# EasyEDA Pro project uven2-mk3-main-board.eprj

# Schematic Schematic1
Board Name: Board1; Create Date: 2025-07-13; Page Name: P1; Project Name: uven2-mk3-main-board; Schematic Name: Schematic1; Update Date: 2025-12-18; Company: EasyEDA.com; Page Size: A4; Version: V1.3
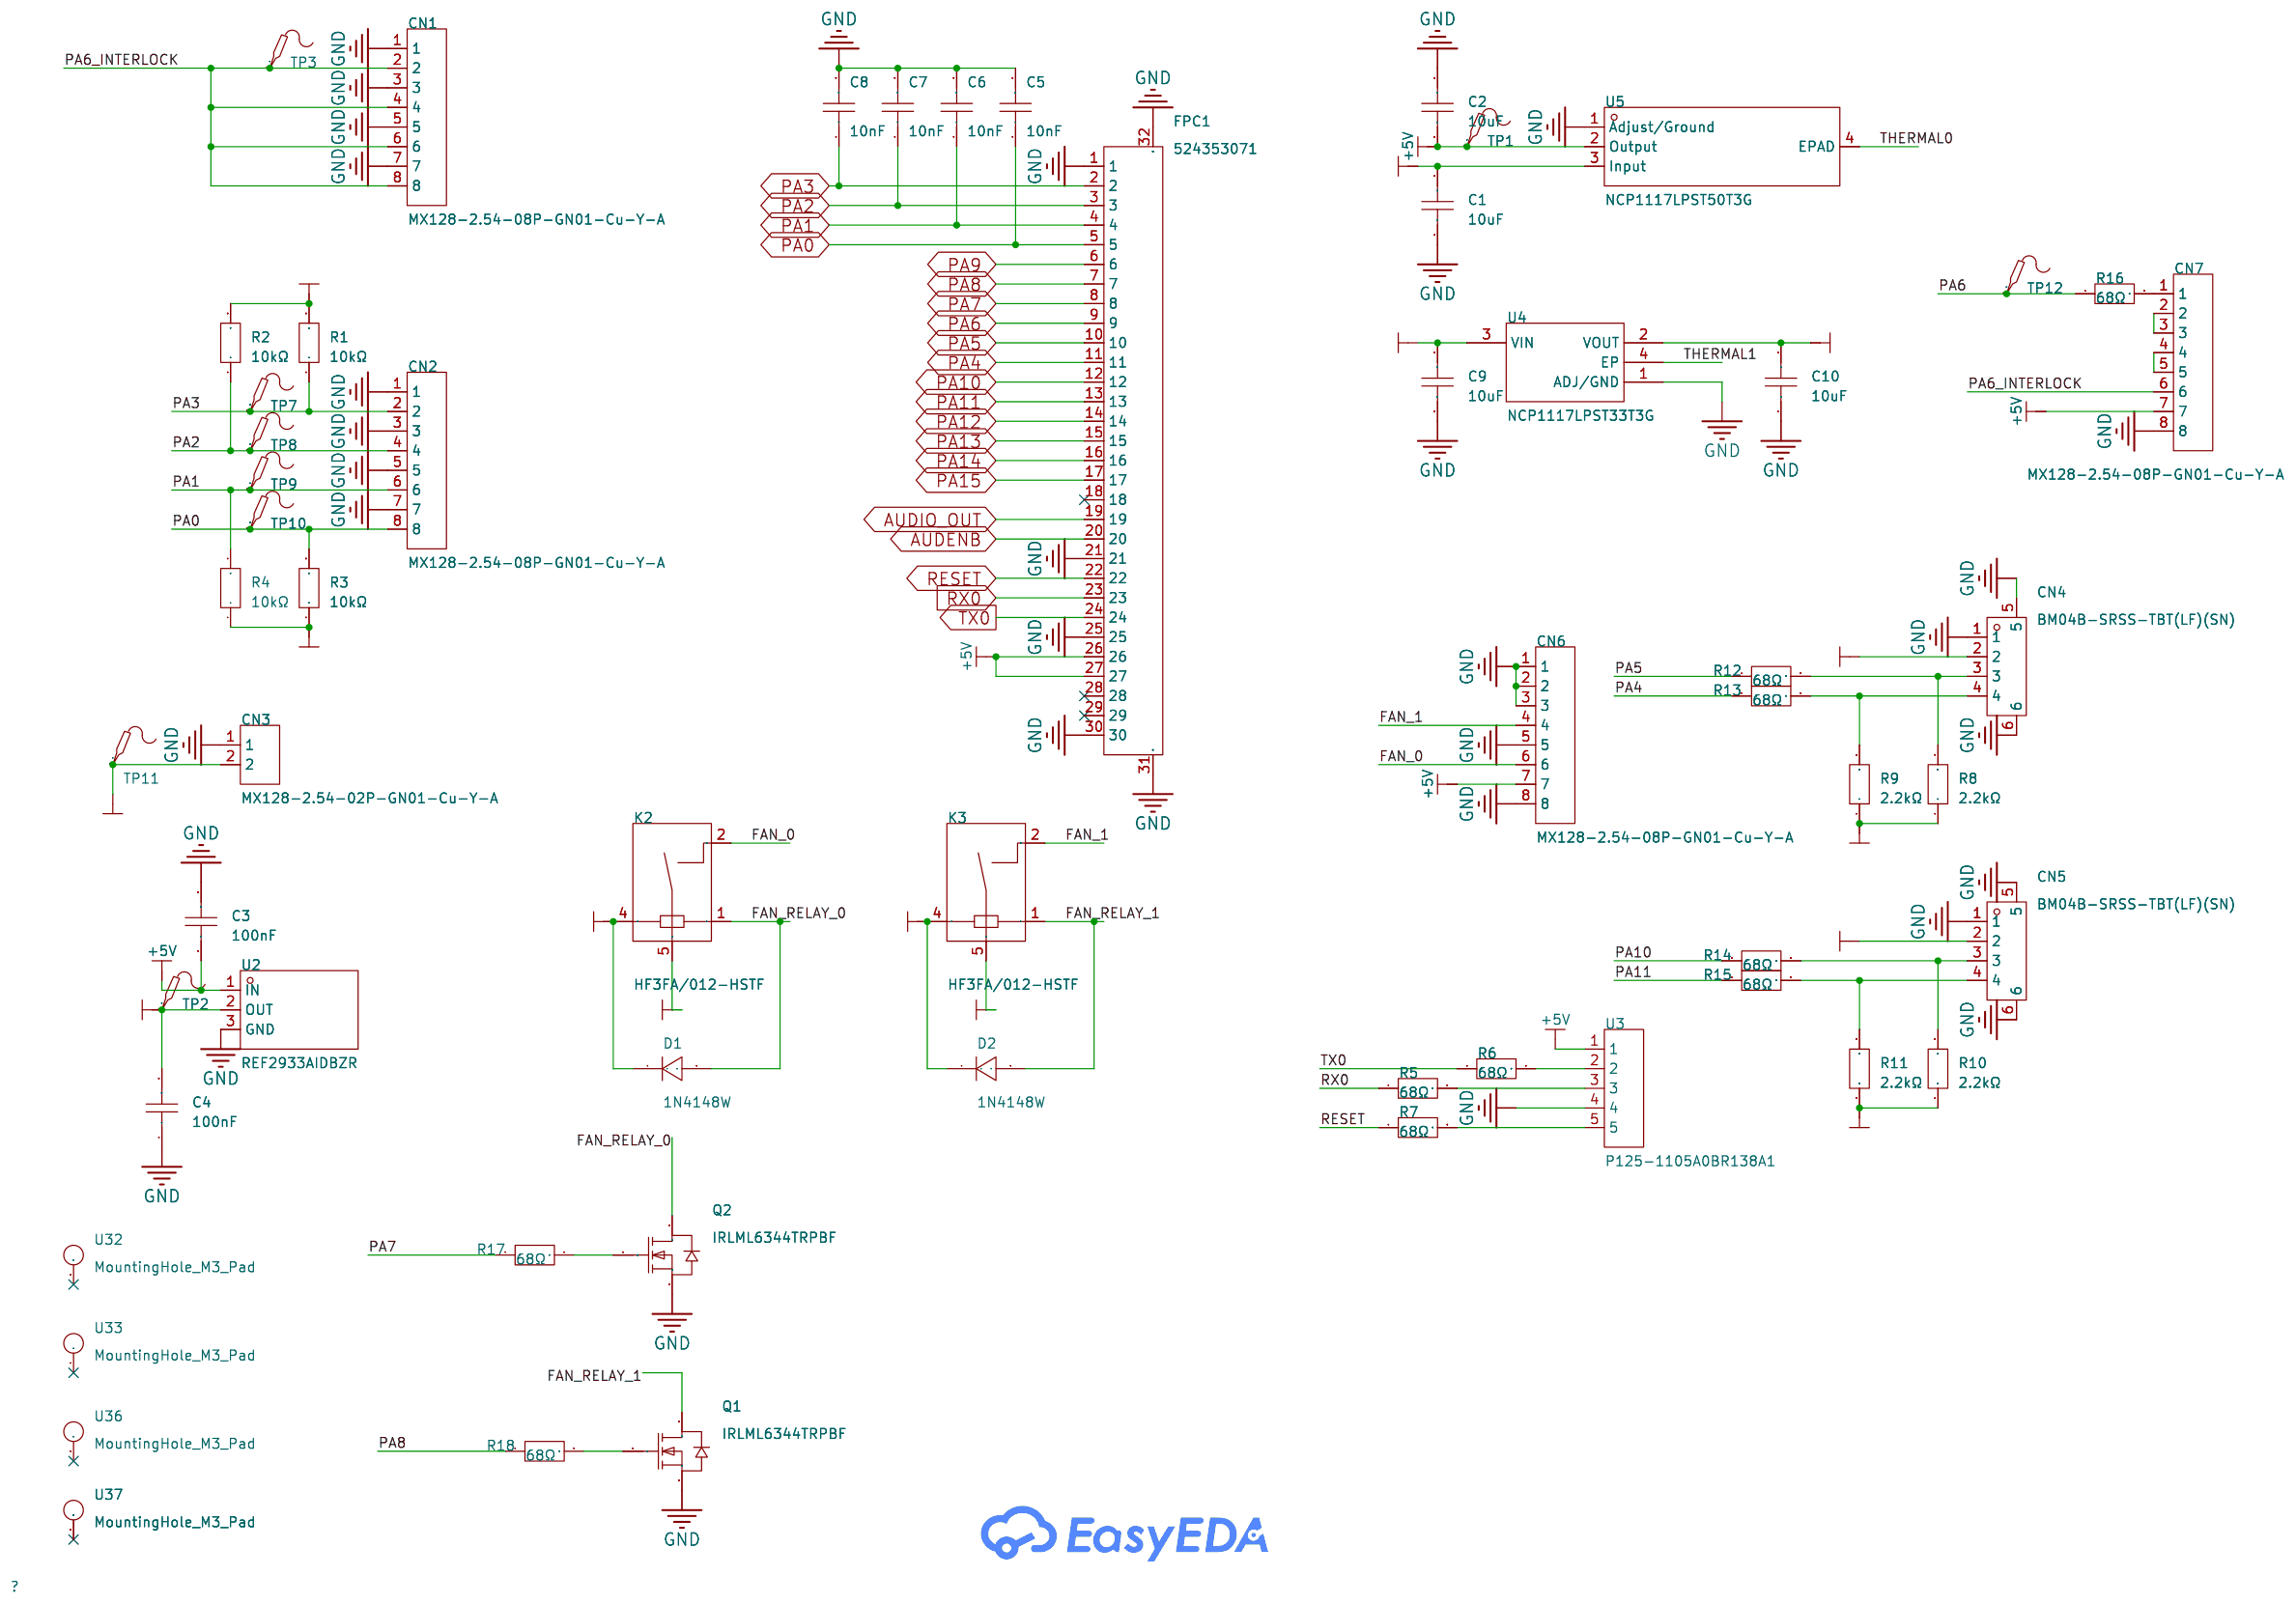
[diagram p0: schematic sheet]

## Parts
C1  10uF  [C0805]
C2  10uF  [C0805]
C3  100nF  [C0603]
C4  100nF  [C0603]
C5  10nF  [C0402]
C6  10nF  [C0402]
C7  10nF  [C0402]
C8  10nF  [C0402]
C9  10uF  [C0805]
C10  10uF  [C0805]
CN1  MX128-2.54-08P-GN01-Cu-Y-A  [CONN-TH_8P-P2.54_MX128-2.54-GN01-08P-CU-Y-A]
CN2  MX128-2.54-08P-GN01-Cu-Y-A  [CONN-TH_8P-P2.54_MX128-2.54-GN01-08P-CU-Y-A]
CN3  MX128-2.54-02P-GN01-Cu-Y-A  [CONN-TH_2P-P2.54_MX128-2.54-GN01-02P-CU-Y-A]
CN4  BM04B-SRSS-TBT(LF)(SN)  [CONN-SMD_BM04B-SRSS-TBT-LF-SN]
CN5  BM04B-SRSS-TBT(LF)(SN)  [CONN-SMD_BM04B-SRSS-TBT-LF-SN]
CN6  MX128-2.54-08P-GN01-Cu-Y-A  [CONN-TH_8P-P2.54_MX128-2.54-GN01-08P-CU-Y-A]
CN7  MX128-2.54-08P-GN01-Cu-Y-A  [CONN-TH_8P-P2.54_MX128-2.54-GN01-08P-CU-Y-A]
D1  1N4148W  [SOD-123F_L2.7-W1.6-LS3.8-RD]
D2  1N4148W  [SOD-123F_L2.7-W1.6-LS3.8-RD]
FPC1  524353071  [FPC-SMD_P0.50-30P_1X30P]
K2  HF3FA/012-HSTF  [RELAY-TH_HF3FA-XX-HXX-XXX]
K3  HF3FA/012-HSTF  [RELAY-TH_HF3FA-XX-HXX-XXX]
Q1  IRLML6344TRPBF  [SOT-23-3_L2.9-W1.6-P1.90-LS2.8-BR]
Q2  IRLML6344TRPBF  [SOT-23-3_L2.9-W1.6-P1.90-LS2.8-BR]
R1  10kΩ  [R0603]
R2  10kΩ  [R0603]
R3  10kΩ  [R0603]
R4  10kΩ  [R0603]
R5  68Ω  [R0402]
R6  68Ω  [R0402]
R7  68Ω  [R0402]
R8  2.2kΩ  [R0402]
R9  2.2kΩ  [R0402]
R10  2.2kΩ  [R0402]
R11  2.2kΩ  [R0402]
R12  68Ω  [R0402]
R13  68Ω  [R0402]
R14  68Ω  [R0402]
R15  68Ω  [R0402]
R16  68Ω  [R0402]
R17  68Ω  [R0402]
R18  68Ω  [R0402]
TP1  -  [Test-Point-0.5mm]
TP2  -  [Test-Point-0.5mm]
TP3  -  [Test-Point-0.5mm]
TP7  -  [Test-Point-0.5mm]
TP8  -  [Test-Point-0.5mm]
TP9  -  [Test-Point-0.5mm]
TP10  -  [Test-Point-0.5mm]
TP11  -  [Test-Point-0.5mm]
TP12  -  [Test-Point-0.5mm]
U2  REF2933AIDBZR  [SOT-23-3_L2.9-W1.3-P1.90-LS2.4-BR]
U3  P125-1105A0BR138A1  [HDR-TH_5P-P2.54-H-M-W10.4]
U4  NCP1117LPST33T3G  [SOT-223_L6.5-W3.5-P2.30-LS7.0-BR]
U5  NCP1117LPST50T3G  [SOT-223_L6.5-W3.5-P2.30-LS7.0-BR]
U32  MountingHole_M3_Pad  [MountingHole_3.2mm_M3_DIN965_Pad_TopOnly]
U33  MountingHole_M3_Pad  [MountingHole_3.2mm_M3_DIN965_Pad_TopOnly]
U36  MountingHole_M3_Pad  [MountingHole_3.2mm_M3_DIN965_Pad_TopOnly]
U37  MountingHole_M3_Pad  [MountingHole_3.2mm_M3_DIN965_Pad_TopOnly]

## Library data of the parts
C1 C2 C9 C10 = FCC0805X106K250FT: LCSC Part Name: 10uF ±10% 25V; Supplier Part: C5137488; Manufacturer: FOJAN(富捷); Supplier Footprint: 0805; JLCPCB Part Class: Extended Part; Datasheet: https://atta.szlcsc.com/upload/public/pdf/source/20220818/0EB3B7FB2F5648AC16609637FBA7DABE.pdf; Supplier: LCSC; Tolerance: ±10%; Voltage Rating: 25V; Temperature Coefficient: X5R
C3 C4 = C0603C104K4RACTU: LCSC Part Name: 100nF ±10% 16V; Supplier Part: C2181816; Manufacturer: KEMET(基美); Supplier Footprint: 0603; JLCPCB Part Class: Extended Part; Datasheet: https://atta.szlcsc.com/upload/public/pdf/source/20210401/FA43491E9CEFD02B2522131A2AAB865C.pdf; Supplier: LCSC; Tolerance: ±10%; Voltage Rating: 16V; Temperature Coefficient: X7R
C5-C8 = GRT155R71C103KE01D: LCSC Part Name: 10nF ±10% 16V; Supplier Part: C7282662; Manufacturer: muRata(村田); Supplier Footprint: 0402; JLCPCB Part Class: Extended Part; Datasheet: https://atta.szlcsc.com/upload/public/pdf/source/20230811/4183D12B053182B3B4A4F1F618773605.pdf; Supplier: LCSC; Tolerance: ±10%; Voltage Rating: 16V; Temperature Coefficient: X7R
CN1 CN2 CN6 CN7 = MX128-2.54-08P-GN01-Cu-Y-A: LCSC Part Name: 1x8P 2.54mm 直插 排数:1 每排P数:8; Supplier Part: C5188448; Manufacturer: MAX(迈旭); Supplier Footprint: 插件,P=2.54mm; JLCPCB Part Class: Extended Part; Datasheet: https://atta.szlcsc.com/upload/public/pdf/source/20250320/39CF67EAC718F5AC600D0D1AE915BA0E.pdf; Supplier: LCSC; Number of Positions or Pins: 1x8P; Pitch: 2.54mm; Color: Green; Mounting Type: Direct Insert; Number of Pins: 8P; Number of Rows: 1; Number of PINs Per Row: 8; Screw Specification: M1.6; Current Rating: 6A; Voltage Rating (Max): 150V; Wire Gauge - AWG: 18~24; Wire Gauge - mm2: 1; Operating Temperature: -40℃~+105℃
CN3 = MX128-2.54-02P-GN01-Cu-Y-A: LCSC Part Name: 1x2P 2.54mm 直插 排数:1 每排P数:2; Supplier Part: C5188442; Manufacturer: MAX(迈旭); Supplier Footprint: 插件,P=2.54mm; JLCPCB Part Class: Extended Part; Datasheet: https://atta.szlcsc.com/upload/public/pdf/source/20250320/39CF67EAC718F5AC600D0D1AE915BA0E.pdf; Supplier: LCSC; Number of Positions or Pins: 1x2P; Pitch: 2.54mm; Color: Green; Mounting Type: Direct Insert; Number of Pins: 2P; Number of Rows: 1; Number of PINs Per Row: 2; Screw Specification: M1.6; Current Rating: 6A; Voltage Rating (Max): 150V; Wire Gauge - AWG: 18~24; Wire Gauge - mm2: 1; Operating Temperature: -40℃~+105℃
CN4 CN5 = BM04B-SRSS-TBT(LF)(SN): LCSC Part Name: 1x4P 间距:1mm 立贴 系列:SH; Supplier Part: C495539; Manufacturer: JST; Supplier Footprint: SMD,P=1mm; JLCPCB Part Class: Extended Part; Datasheet: https://atta.szlcsc.com/upload/public/pdf/source/20200311/C495539_4B291EBEBD1ECED2F6F483F97D0425DB.pdf; Supplier: LCSC; Pins Structure: 1x4P; Pitch: 1mm; Mounting Style: Brick nogging; Reference Series: SH; Number of Pins: 4P; Number of Rows: 1; Number of PINs Per Row: 4; Current Rating (Max): 1A; Contact Material: Copper Alloy; Contact Plating: Tin; Operating Temperature Range: -25℃~+85℃; Rated Voltage (Max): 50V; Plastic Material: PA; Flame Retardant Rating: UL94V-0; Supplementary Features: 辅助焊脚; Colour: White; Z-Height of the Board: 4.25mm; X-Length of Bottom Edge on Board (Spacing Line): 6mm; Y-Width of Bottom Edge on Board: 3.6mm
D1 D2 = 1N4148W_C81598: Supplier Part: C81598; Manufacturer: ST(先科); Supplier Footprint: SOD-123; JLCPCB Part Class: Basic Part; Datasheet: https://item.szlcsc.com/datasheet/1N4148W/82750.html; Supplier: LCSC; Diode Configuration: Independent; Voltage - Forward(Vf@If): 1V@50mA; Voltage - DC Reverse(Vr): 75V; Current - Rectified: 150mA; Pd - Power Dissipation: 400mW; Reverse Leakage Current (Ir): 1uA@75V; Reverse Recovery Time (trr): 4ns; Non-Repetitive Peak Forward Surge Current: 1A
FPC1 = 524353071: LCSC Part Name: 间距:0.5mm P数:30P 抽屉式 上接; Supplier Part: C122420; Manufacturer: MOLEX; Supplier Footprint: SMD,P=0.5mm,卧贴; JLCPCB Part Class: Extended Part; Datasheet: https://atta.szlcsc.com/upload/public/pdf/source/231023/524352471_sd-36a0dfa662c3076f8e651b52be6ecca2.pdf; Supplier: LCSC; Locking Feature: Slide Lock; Contact Type: Contact,Top; Number of Contacts: 30P; Pitch: 0.5mm; Mounting Type: Surface Mount; FFC, FCB Thickness: 0.3mm; Height Above Board: 2mm
K2 K3 = HF3FA/012-HSTF: LCSC Part Name: 超小型大功率12V继电器 单刀单掷-常开; Supplier Part: C358639; Manufacturer: HF(宏发); Supplier Footprint: 插件,15.2x19mm; JLCPCB Part Class: Extended Part; Datasheet: https://atta.szlcsc.com/upload/public/pdf/source/20190107/C358639_A94E254D24C6DC58C6B8C43B67E8919D.pdf; Supplier: LCSC; Coil Voltage: 12V; Contact Form: One Normally Open: 1A (SPST-NO); Number of Pins: 4; Contact Rating: 10A@28VDC；10A@277VAC; Switching Voltage(Max): 277V@AC；28V@DC; Coil Rated Power: 360mW; Contact Material: AgSnO2; Switching Current(Max): 15A; Coil Type: Non-polar - Single Coil; Coil Resistance: 400Ω; Contact Resistance: 100mΩ; Operate Time: 10ms; Release Time: 5ms; Operating Temperature: -40℃~+85℃
Q1 Q2 = IRLML6344TRPBF: LCSC Part Name: 1个N沟道 耐压:30V 电流:5A; Supplier Part: C53550; Manufacturer: Infineon(英飞凌); Supplier Footprint: SOT-23; JLCPCB Part Class: Extended Part; Datasheet: https://atta.szlcsc.com/upload/public/pdf/source/20210610/C53550_65719F40D28C6A3D6212C145E14C98AC.pdf; Supplier: LCSC; Type: 1 N-Channel; Drain Source On Resistance (RDS(on)@Vgs,Id): 29mΩ@4.5V,5.0A; Gate Threshold Voltage (Vgs(th)@Id): 1.1V@10uA; Total Gate Charge (Qg@Vgs): 6.8nC; Input Capacitance (Ciss@Vds): 650pF; Reverse Transfer Capacitance (Crss@Vds): 46pF; Operating Temperature: -55℃~+150℃
R1-R4 = RCA0310KFLF: LCSC Part Name: 10kΩ ±1% 100mW; Supplier Part: C22356465; Manufacturer: HKR(香港电阻); Supplier Footprint: 0603; JLCPCB Part Class: Extended Part; Datasheet: https://atta.szlcsc.com/upload/public/pdf/source/20240312/EB29F8B3E9AD4CE07E65E9956C47F4F5.pdf; Supplier: LCSC; Tolerance: ±1%; Power(Watts): 100mW
R5-R7 R12-R18 = FRC0402F68R0TS: LCSC Part Name: 68Ω ±1% 62.5mW 厚膜电阻; Supplier Part: C2909380; Manufacturer: FOJAN(富捷); Supplier Footprint: 0402; JLCPCB Part Class: Extended Part; Datasheet: https://atta.szlcsc.com/upload/public/pdf/source/20211221/925EC7D7225764EE0046F22065062C87.pdf; Supplier: LCSC; Type: Thick Film Resistors; Tolerance: ±1%; Power(Watts): 1/16W; Voltage-Supply(Max): 50V; Temperature Coefficient: ±100ppm/℃; Operating Temperature: -55℃~+155℃
R8-R11 = FRC0402J222 TS: LCSC Part Name: 2.2kΩ ±5% 62.5mW 厚膜电阻; Supplier Part: C2906920; Manufacturer: FOJAN(富捷); Supplier Footprint: 0402; JLCPCB Part Class: Extended Part; Datasheet: https://atta.szlcsc.com/upload/public/pdf/source/20211221/925EC7D7225764EE0046F22065062C87.pdf; Supplier: LCSC; Type: Thick Film Resistor; Tolerance: ±5%; Power(Watts): 62.5mW; Voltage-Supply(Max): 50V; Temperature Coefficient: ±100ppm/℃; Operating Temperature: -55℃~+155℃
TP1-TP3 TP7-TP12 = Test-Point
U2 = REF2933AIDBZR: Supplier Part: C83174; Manufacturer: TI(德州仪器); Supplier Footprint: SOT-23; JLCPCB Part Class: Extended Part; Datasheet: https://www.ti.com/cn/lit/gpn/ref2912; Supplier: LCSC; Output Type: Fixed; Input Voltage: 3.35V~5.5V; Output Voltage: 3.3V; Output Current: 25mA; Tolerance: ±2%; Temperature Coefficient: 100ppm/℃; Reference Type: series connection; Supply Current: 59uA; Noise - 10Hz to 10kHz: 105uVrms; Operating Temperature: -40℃~+125℃@(Ta)
U3 = P125-1105A0BR138A1: LCSC Part Name: 1x5P 间距:2.54mm 方针 弯插; Supplier Part: C19190479; Manufacturer: Yxcon(宇熙精密); Supplier Footprint: 弯插,P=2.54mm; JLCPCB Part Class: Extended Part; Datasheet: https://atta.szlcsc.com/upload/public/pdf/source/20231110/B4ABAE5F26C4676492BFDA946B0BE3CA.pdf; Supplier: LCSC; Pin Structure: 1x5P; Pitch: 2.54mm; Row Spacing: 2.54mm; Circluar Pins/Square Pins: Policy; Mounting Type: Right-Angle; Number of Rows: Single Row; Number of Pins: 5P; Length of Mating Pin: 6mm; Insulation Height: 2.5mm; Contact Material: Brass; Contact Plating: Gold; Operating Temperature: -40℃~+105℃; Color: Black
U4 = NCP1117LPST33T3G: LCSC Part Name: 输入18V 输出3.3V 1A; Supplier Part: C146799; Manufacturer: onsemi(安森美); Supplier Footprint: SOT-223; JLCPCB Part Class: Extended Part; Datasheet: https://atta.szlcsc.com/upload/public/pdf/source/20191203/C463121_AD9888B71E4C5D51195BC79A2CB92F43.pdf; Supplier: LCSC; Output Type: Fixed; Maximum Input Voltage: 18V; Output Voltage: 3.3V; Output Current: 1A; Power Supply Rejection Ratio (PSRR): 60dB@(120Hz); Dropout Voltage: 1.4V@(1A); standby current: 700uA; Feature: ESD Protection；Thermal Protection(TSD)；Overcurrent Protection(OCP); Operating Temperature: 0℃~+125℃; Output Polarity: Positive electrode; Number of Outputs: 1
U5 = NCP1117LPST50T3G: LCSC Part Name: 输入18V 输出5V 1A; Supplier Part: C185806; Manufacturer: onsemi(安森美); Supplier Footprint: SOT-223; JLCPCB Part Class: Extended Part; Datasheet: https://atta.szlcsc.com/upload/public/pdf/source/20221020/BE03C0E7B462FDEAA2EFA8511CCFDD73.pdf; Supplier: LCSC; Output Type: Fixed; Maximum Input Voltage: 18V; Output Voltage: 5V; Output Current: 1A; Power Supply Rejection Ratio (PSRR): 60dB@(120Hz); Dropout Voltage: 1.4V@(1A); standby current: 700uA; Feature: ESD Protection；Thermal Protection(TSD)；Overcurrent Protection(OCP); Operating Temperature: 0℃~+125℃; Output Polarity: Positive electrode; Number of Outputs: 1
U32 U33 U36 U37 = Mounting_M3_Hole_Pad

## Nets
+3.3V: C10.2 CN4.2 CN5.2 R8.1 R9.1 R10.1 R11.1 U4.2(VOUT)
+3.3VREF: C4.2 R1.2 R2.2 R3.1 R4.1 TP2.1 U2.2(OUT)
+5V: C2.2 C3.1 CN6.7 CN7.7 FPC1.26 FPC1.27 TP1.1 U2.1(IN) U3.1 U5.2(Output)
+12V: C1.2 C9.2 CN3.2 D1.1(K) D2.1(K) K2.4 K2.5 K3.4 K3.5 TP11.1 U4.3(VIN) U5.3(Input)
GND: C1.1 C2.1 C3.2 C4.1 C5.2 C6.2 C7.2 C8.2 C9.1 C10.1 CN1.1 CN1.3 CN1.5 CN1.7 CN2.1 CN2.3 CN2.5 CN2.7 CN3.1 CN4.1 CN4.5 CN4.6 CN5.1 CN5.5 CN5.6 CN6.1 CN6.2 CN6.3 CN6.5 CN6.8 CN7.8 FPC1.1 FPC1.21 FPC1.25 FPC1.30 FPC1.31 FPC1.32 Q1.2(S) Q2.2(S) U2.3(GND) U3.4 U4.1(ADJ/GND) U5.1(Adjust/Ground)
AUDENB: FPC1.20
AUDIO_OUT: FPC1.19
FAN_0: CN6.6 K2.2
FAN_1: CN6.4 K3.2
FAN_RELAY_0: D1.2(A) K2.1 Q2.3(D)
FAN_RELAY_1: D2.2(A) K3.1 Q1.3(D)
PA0: C5.1 CN2.8 FPC1.5 R3.2 TP10.1
PA1: C6.1 CN2.6 FPC1.4 R4.2 TP9.1
PA2: C7.1 CN2.4 FPC1.3 R2.1 TP8.1
PA3: C8.1 CN2.2 FPC1.2 R1.1 TP7.1
PA4: FPC1.11 R13.1
PA5: FPC1.10 R12.1
PA6: FPC1.9 R16.1 TP12.1
PA6_INTERLOCK: CN1.2 CN1.4 CN1.6 CN1.8 CN7.6 TP3.1
PA7: FPC1.8 R17.1
PA8: FPC1.7 R18.1
PA9: FPC1.6
PA10: FPC1.12 R14.1
PA11: FPC1.13 R15.1
PA12: FPC1.14
PA13: FPC1.15
PA14: FPC1.16
PA15: FPC1.17
RESET: FPC1.22 R7.1
RX0: FPC1.23 R5.1
THERMAL0: U5.4(EPAD)
THERMAL1: U4.4(EP)
TX0: FPC1.24 R6.1
$1N3013: R6.2 U3.2
$1N3017: R5.2 U3.3
$1N3080: R7.2 U3.5
$1N3583: CN4.3 R8.2 R12.2
$1N3587: CN4.4 R9.2 R13.2
$1N4118: CN5.4 R11.2 R15.2
$1N4125: CN5.3 R10.2 R14.2
$1N12881: Q2.1(G) R17.2
$1N13084: Q1.1(G) R18.2
$1N19649: CN7.1 R16.2
$1N19688: CN7.2 CN7.3
$1N19692: CN7.4 CN7.5

Not connected (* = marked no-connect by the designer): FPC1 18* 28* 29*; U32 1*; U33 1*; U36 1*; U37 1*

# Board PCB1
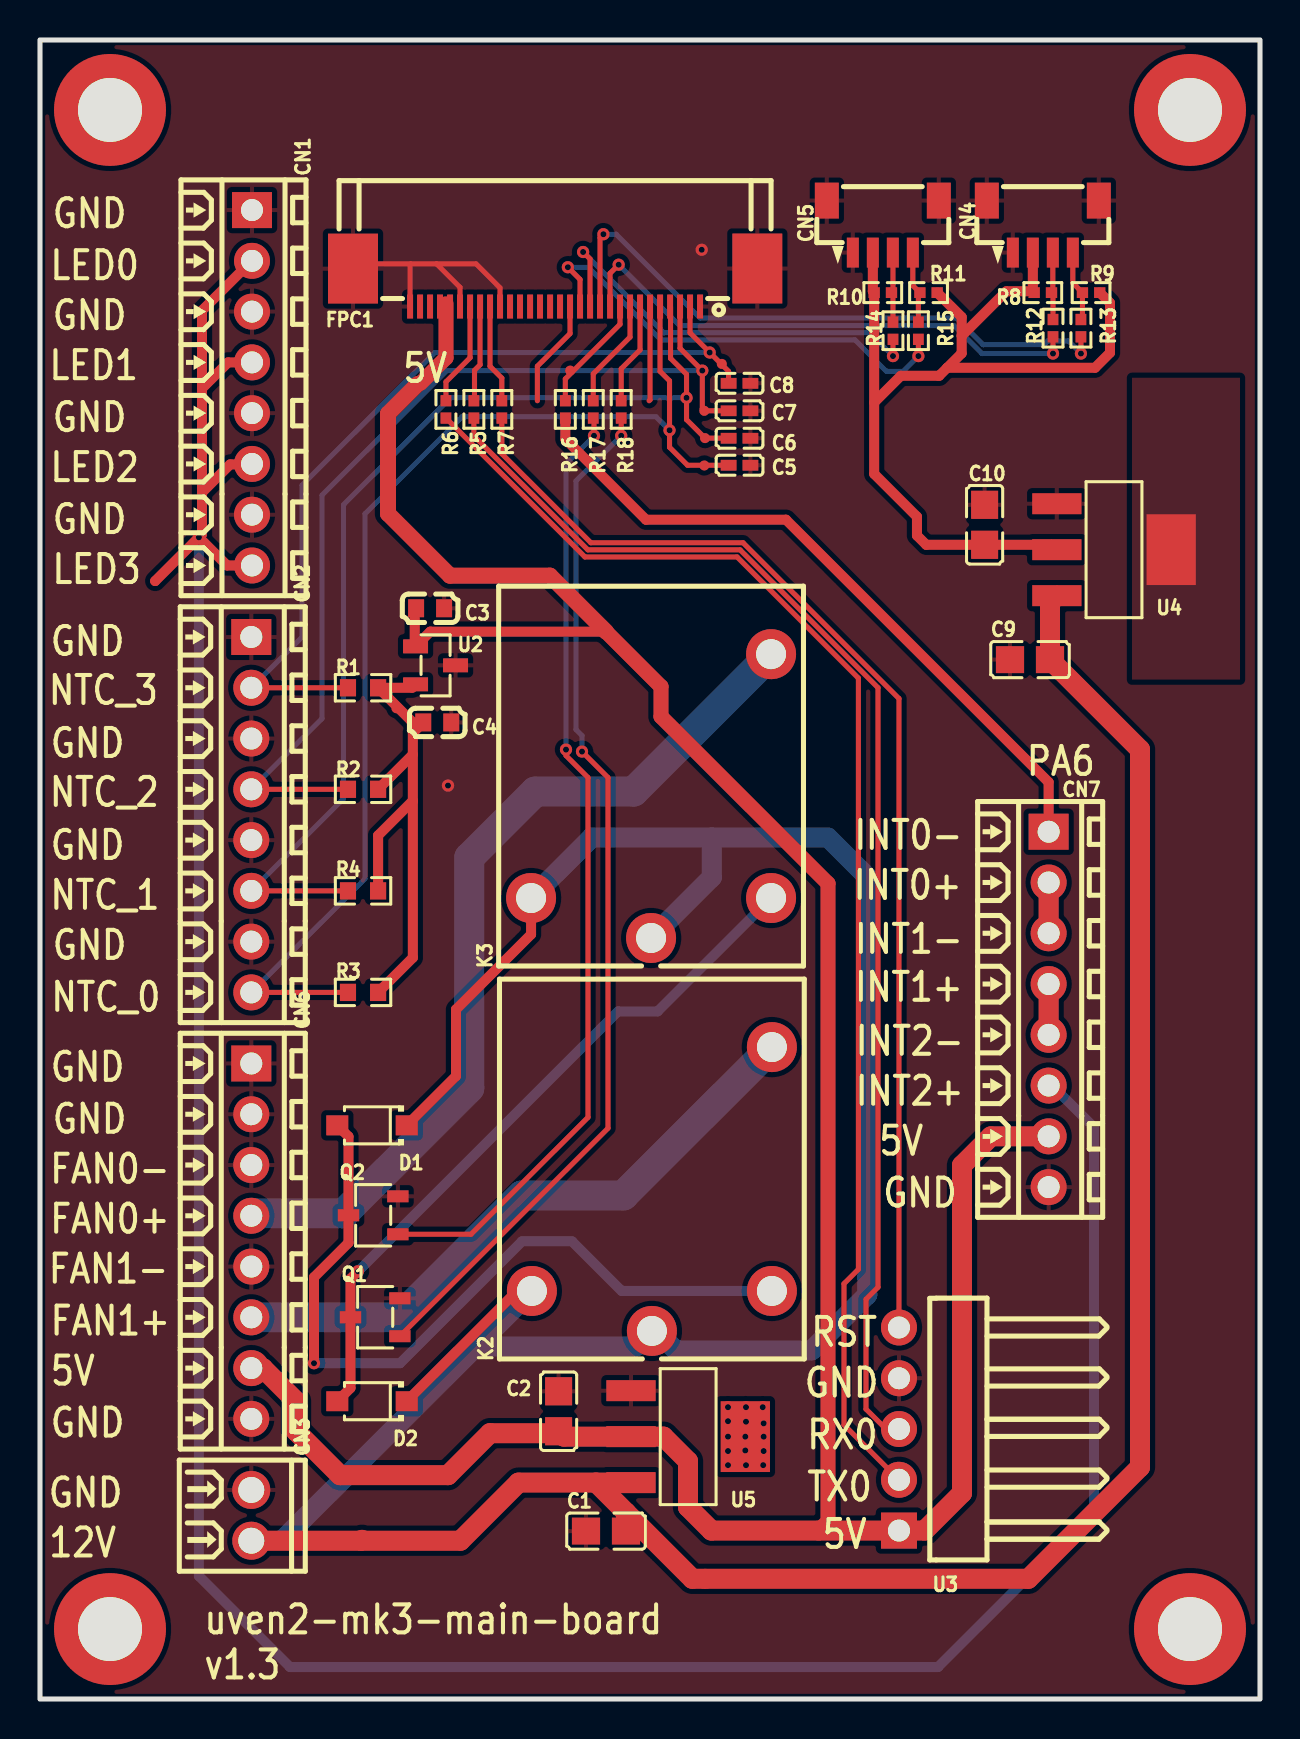
[diagram p1: board, top side]
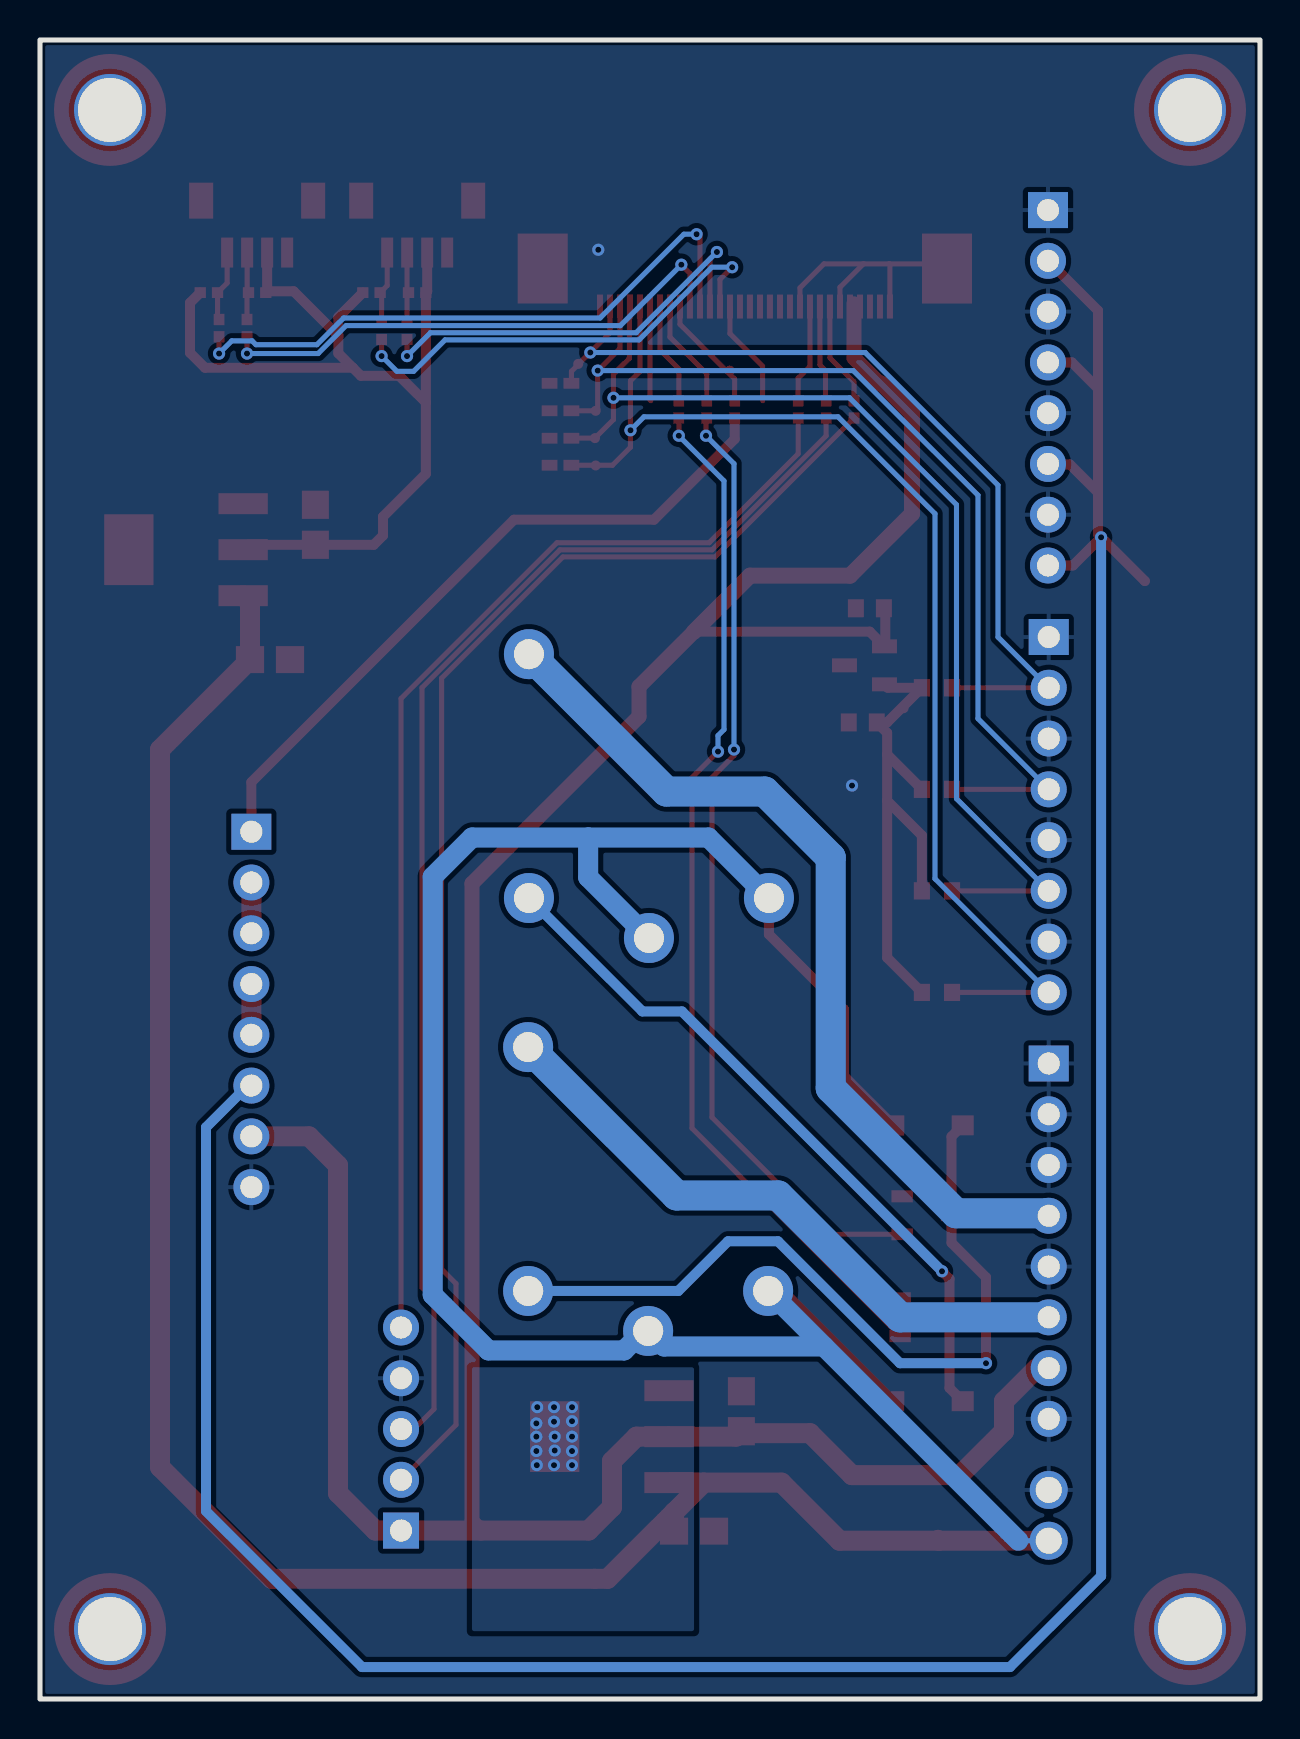
[diagram p2: board, bottom side, seen from below]

Outline 61 x 83 mm; copper layers: Top Layer, Bottom Layer. Coordinates in mm from the lower left corner of the outline.
Outline path: rectangle 0,83 61,0
Stack: Top Layer 0.035mm / Dielectric1 1.51mm FR4 er 4.5 / Bottom Layer 0.035mm

## Design rules (mm)
template: JLCPCB Capability(Two Layers Board)
spacing copperThickness1oz (default): track to track 0.102, other pairs 0.152 to 0.3
spacing copperThickness2oz: track to track 0.203, other pairs 0.152 to 0.3
track width copperThickness1oz (default): min 0.127, default 0.254, max 2.54
track width copperThickness2oz: min 0.203, default 0.254, max 2.54
differential pair differentialPair (default): width min 0.127, default 0.254, max 2.54; gap min 0.152, default 0.152
via viaSize (default): diameter min 0.5, default 0.61, max 10; hole min 0.3, default 0.305, max 6.3

## Placement (name value [footprint] x y rotation side)
C1  10uF  [C0805]  28.3 8.4 0 top
C2  10uF  [C0805]  25.93 14.4 270 top
C3  100nF  [C0603]  19.5 54.57 0 top
C4  100nF  [C0603]  19.86 48.86 180 top
C5  10nF  [C0402]  34.98 61.72 0 top
C6  10nF  [C0402]  34.98 63.07 0 top
C7  10nF  [C0402]  34.98 64.45 0 top
C8  10nF  [C0402]  34.98 65.82 0 top
C9  10uF  [C0805]  49.5 52 0 top
C10  10uF  [C0805]  47.23 58.74 270 top
CN1  MX128-2.54-08P-GN01-Cu-Y-A  [CONN-TH_8P-P2.54_MX128-2.54-GN01-08P-CU-Y-A]  10.6 65.6 270 top
CN2  MX128-2.54-08P-GN01-Cu-Y-A  [CONN-TH_8P-P2.54_MX128-2.54-GN01-08P-CU-Y-A]  10.56 44.24 270 top
CN3  MX128-2.54-02P-GN01-Cu-Y-A  [CONN-TH_2P-P2.54_MX128-2.54-GN01-02P-CU-Y-A]  10.56 9.19 270 top
CN4  BM04B-SRSS-TBT(LF)(SN)  [CONN-SMD_BM04B-SRSS-TBT-LF-SN]  50.14 73.66 180 top
CN5  BM04B-SRSS-TBT(LF)(SN)  [CONN-SMD_BM04B-SRSS-TBT-LF-SN]  42.14 73.66 180 top
CN6  MX128-2.54-08P-GN01-Cu-Y-A  [CONN-TH_8P-P2.54_MX128-2.54-GN01-08P-CU-Y-A]  10.56 22.91 270 top
CN7  MX128-2.54-08P-GN01-Cu-Y-A  [CONN-TH_8P-P2.54_MX128-2.54-GN01-08P-CU-Y-A]  50.43 34.5 270 top
D1  1N4148W  [SOD-123F_L2.7-W1.6-LS3.8-RD]  16.6 28.7 180 top
D2  1N4148W  [SOD-123F_L2.7-W1.6-LS3.8-RD]  16.6 14.9 180 top
FPC1  524353071  [FPC-SMD_P0.50-30P_1X30P]  25.76 70.61 0 top
K2  HF3FA/012-HSTF  [RELAY-TH_HF3FA-XX-HXX-XXX]  30.59 25.52 90 top
K3  HF3FA/012-HSTF  [RELAY-TH_HF3FA-XX-HXX-XXX]  30.55 45.17 90 top
Q1  IRLML6344TRPBF  [SOT-23-3_L2.9-W1.6-P1.90-LS2.8-BR]  16.76 19.1 0 top
Q2  IRLML6344TRPBF  [SOT-23-3_L2.9-W1.6-P1.90-LS2.8-BR]  16.66 24.2 0 top
R1  10kΩ  [R0603]  16.15 50.59 0 top
R2  10kΩ  [R0603]  16.15 45.51 0 top
R3  10kΩ  [R0603]  16.15 35.35 180 top
R4  10kΩ  [R0603]  16.15 40.43 180 top
R5  68Ω  [R0402]  21.69 64.52 270 top
R6  68Ω  [R0402]  20.3 64.52 270 top
R7  68Ω  [R0402]  23.09 64.52 270 top
R8  2.2kΩ  [R0402]  50.14 70.36 0 top
R9  2.2kΩ  [R0402]  52.56 70.36 180 top
R10  2.2kΩ  [R0402]  42.14 70.36 0 top
R11  2.2kΩ  [R0402]  44.43 70.36 180 top
R12  68Ω  [R0402]  50.65 68.58 90 top
R13  68Ω  [R0402]  52.05 68.58 90 top
R14  68Ω  [R0402]  42.65 68.46 90 top
R15  68Ω  [R0402]  43.92 68.46 90 top
R16  68Ω  [R0402]  26.27 64.52 270 top
R17  68Ω  [R0402]  27.66 64.52 270 top
R18  68Ω  [R0402]  29.06 64.52 270 top
TP1  -  [Test-Point-0.5mm]  20.23 67.96 0 top
TP2  -  [Test-Point-0.5mm]  17.82 49.57 0 top
TP3  -  [Test-Point-0.5mm]  5.76 55.93 0 top
TP7  -  [Test-Point-0.5mm]  34.09 66.79 0 top
TP8  -  [Test-Point-0.5mm]  33.22 64.45 0 top
TP9  -  [Test-Point-0.5mm]  33.25 63.08 0 top
TP10  -  [Test-Point-0.5mm]  33.22 61.71 0 top
TP11  -  [Test-Point-0.5mm]  33.26 6.01 0 top
TP12  -  [Test-Point-0.5mm]  26.51 66.46 0 top
U2  REF2933AIDBZR  [SOT-23-3_L2.9-W1.3-P1.90-LS2.4-BR]  19.78 51.71 180 top
U3  P125-1105A0BR138A1  [HDR-TH_5P-P2.54-H-M-W10.4]  42.95 13.51 90 top
U4  NCP1117LPST33T3G  [SOT-223_L6.5-W3.5-P2.30-LS7.0-BR]  53.7 57.5 180 top
U5  NCP1117LPST50T3G  [SOT-223_L6.5-W3.5-P2.30-LS7.0-BR]  32.41 13.13 180 top
U32  MountingHole_M3_Pad  [MountingHole_3.2mm_M3_DIN965_Pad_TopOnly]  3.5 79.5 0 top
U33  MountingHole_M3_Pad  [MountingHole_3.2mm_M3_DIN965_Pad_TopOnly]  57.5 79.5 0 top
U36  MountingHole_M3_Pad  [MountingHole_3.2mm_M3_DIN965_Pad_TopOnly]  3.5 3.5 0 top
U37  MountingHole_M3_Pad  [MountingHole_3.2mm_M3_DIN965_Pad_TopOnly]  57.5 3.5 0 top

## Footprints (pads in the part's own frame, mm; a bottom-side part is the same pattern mirrored in y, then rotated)
C0402
  rect 0.79x0.54 smd: 1(-0.545,0) 2(0.545,0)
C0603
  rect 0.8x0.9 smd: 1(-0.7,0) 2(0.7,0)
C0805
  rect 1.41x1.35 smd: 1(-1,0) 2(1,0)
CONN-SMD_BM04B-SRSS-TBT-LF-SN
  rect 0.6x1.5 smd: 1(1.5,1.3) 2(0.5,1.3) 3(-0.5,1.3) 4(-1.5,1.3)
  rect 1.2x1.8 smd: 5(-2.8,-1.3) 6(2.8,-1.3)
CONN-TH_2P-P2.54_MX128-2.54-GN01-02P-CU-Y-A
  round 1.9 hole 1.3: 1(-1.27,0) 2(1.27,0)
CONN-TH_8P-P2.54_MX128-2.54-GN01-08P-CU-Y-A
  rect 1.8x2 hole 1.1: 1(-8.89,0)
  round 1.8 hole 1.1: 2(-6.35,0) 3(-3.81,0) 4(-1.27,0) 5(1.27,0) 6(3.81,0) 7(6.35,0) 8(8.89,0)
FPC-SMD_P0.50-30P_1X30P
  rect 0.3x1.2 smd: 1(7.244,-0.951) 2(6.744,-0.951) 3(6.244,-0.951) 4(5.745,-0.951) 5(5.245,-0.951) 6(4.745,-0.951) 7(4.245,-0.951) 8(3.744,-0.951) 9(3.244,-0.951) 10(2.745,-0.951) 11(2.243,-0.951) 12(1.745,-0.951) 13(1.244,-0.951) 14(0.744,-0.951) 15(0.244,-0.951) 16(-0.254,-0.951) 17(-0.757,-0.951) 18(-1.255,-0.951) 19(-1.758,-0.951) 20(-2.256,-0.951) 21(-2.756,-0.951) 22(-3.256,-0.951) 23(-3.754,-0.951) 24(-4.255,-0.951) 25(-4.758,-0.951) 26(-5.255,-0.951) 27(-5.758,-0.951) 28(-6.256,-0.951) 29(-6.756,-0.951) 30(-7.254,-0.951)
  rect 2.5x3.5 smd: 31(-10.108,0.948) 32(10.108,0.951)
HDR-TH_5P-P2.54-H-M-W10.4
  rect 1.8x1.8 hole 1.1: 1(-5.08,0)
  round 1.8 hole 1.1: 2(-2.54,0) 3(0,0) 4(2.54,0) 5(5.08,0)
MountingHole_3.2mm_M3_DIN965_Pad_TopOnly
  round 3.6 hole 3.2: 1(0,0)
  round 5.6 smd: 1(0,0)
R0402
  rect 0.566x0.54 smd: 1(-0.433,0) 2(0.433,0)
R0603
  rect 0.806x0.864 smd: 1(-0.753,0) 2(0.753,0)
RELAY-TH_HF3FA-XX-HXX-XXX
  round 2.5 hole 1.5: 1(-5.1,-6) 2(7.1,-6) 4(-5.1,6) 5(-7.1,0)
SOD-123F_L2.7-W1.6-LS3.8-RD
  rect 1.1x1 smd: 1(-1.735,0) 2(1.735,0)
SOT-23-3_L2.9-W1.3-P1.90-LS2.4-BR
  rect 1.25x0.7 smd: 1(1,-0.95) 2(1,0.95) 3(-1,0)
SOT-23-3_L2.9-W1.6-P1.90-LS2.8-BR
  rect 1.07x0.6 smd: 1(1.235,-0.95) 2(1.235,0.95) 3(-1.235,0)
SOT-223_L6.5-W3.5-P2.30-LS7.0-BR
  rect 2.465x1.05 smd: 1(2.857,-2.3) 2(2.857,0) 3(2.857,2.3)
  rect 2.465x3.54 smd: 4(-2.857,0)
Test-Point-0.5mm
  round 0.5 smd: 1(0,0)

## Nets
As in the schematic.

Pads without a net: FPC1 18 28 29; U32 1; U33 1; U36 1; U37 1

## Via types
v1: diameter 0.61, hole 0.305, Top Layer to Bottom Layer, 36 vias

## Routing (per net, layer and track width the routed paths; a pad name or vN(x,y) marks a point on that pad's centre or on a via; arc(x,y) is an arc through that point)
+3.3V: length 49.5
  Top Layer w0.5: CN4.2 49.64,70.43 ; 49.64,70.43 R8.1 ; 49.64,70.43 48.32,70.43 46.08,68.2 ; 41.71,64.86 41.71,61.29 43.85,59.15 43.85,58.21 44.31,57.74 C10.2 50.6,57.74 U4.2 ; 41.71,64.86 43.04,66.2 44.96,66.2 45.36,66.6 ; 41.71,64.86 R10.1 41.64,70.43 CN5.2 ; R11.1 46.08,69.14 46.08,68.2 ; 45.36,66.6 46.08,67.33 46.08,68.2 ; 45.36,66.6 52.75,66.6 53.5,67.35 53.5,69.85 R9.1
+3.3VREF: length 27
  Top Layer w0.5: 18.64,44.94 18.64,37.09 R3.1 ; 18.64,44.94 18.64,47.25 ; 18.64,44.94 16.91,43.2 R4.1 ; R2.2 16.91,45.52 18.64,47.25 ; 18.64,47.25 18.64,48.34 C4.2 18.64,48.86 16.91,50.59 18.61,50.59 U2.2
+5V: length 151.5
  Top Layer w0.5: C3.1 18.74,54.5 18.74,52.76 18.81,52.69 19.51,53.4 28.3,53.4
  Top Layer w0.75: 28.3,53.4 31.05,50.65 31.05,49.15 39.4,40.8 39.4,8.89 38.94,8.43 ; 19.03,65.83 20.3,67.1 20.3,69.8
  Top Layer w0.8: 28.3,53.4 25.5,56.2 20.5,56.2 17.4,59.3 17.4,64.3 18.89,65.79
  Top Layer w1: CN6.7 11.14,16.56 12.8,14.9 12.8,13.4 15,11.2 20.4,11.2 22.5,13.3 25.83,13.3 C2.2 26.2,13.13 U5.2 31.17,13.13 32.4,11.9 32.4,9.6 33.57,8.43 U3.1 44.23,8.43 46.1,10.3 46.1,26.7 47.55,28.15 CN7.7
+12V: length 207.5
  Top Layer w0.5: 24.55,40.07 24.55,38.25 20.8,34.5 20.8,31.16 D1.1 ; D2.1 23.85,20.42 K2.4
  Top Layer w1: 16.05,7.92 CN3.2 ; 16.05,7.92 21.02,7.92 23.93,10.83 27.81,10.83 ; 16.05,7.92 16.1,7.97 ; 27.81,10.83 29.3,9.33 ; 27.81,10.83 U5.3 ; 29.3,9.33 C1.2 ; 29.3,9.33 32.62,6.01 TP11.1 49.41,6.01 55,11.6 55,47.5 C9.2 50.5,54.86 U4.3
  Bottom Layer w0.254: 12.08,7.92 CN3.2
  Bottom Layer w1: 24.58,20.42 21.8,17.64 ; 21.8,17.64 29.8,17.64 30.58,18.42 ; 21.8,17.64 12.08,7.92 ; 24.55,40.07 27.58,43.1 33.59,43.1 ; 33.59,43.1 33.59,41.11 30.55,38.07 ; 33.59,43.1 39.4,43.1 41.36,41.14 41.36,20.23 38.58,17.44 31.8,17.44 30.82,18.42 K2.5
GND: length 13.7
  Top Layer w0.254: 18.54,71.8 18.5,71.77 FPC1.30 ; 18.54,71.8 15.89,71.8 FPC1.31 ; 18.54,71.8 19.83,71.8 ; FPC1.21 23,70.6 21.8,71.8 19.83,71.8 ; 19.83,71.8 21,70.63 FPC1.25
  vias: v1(20.4,45.7) v1(33.09,72.5)
FAN_0: length 31.6
  Bottom Layer w1.5: CN6.6 18,19.1 24.09,25.19 29.17,25.19 K2.2
FAN_1: length 44.4
  Bottom Layer w1.5: K3.2 29.68,45.4 24.76,45.4 21.46,42.1 21.46,30.56 15.2,24.3 10.69,24.3 CN6.4
FAN_RELAY_0: length 39.3
  Top Layer w0.5: 14.87,28.7 15.42,28.14 Q2.3 15.42,22.82 13.7,21.1 v1(13.7,16.8)
  Bottom Layer w0.5: v1(13.7,16.8) 18,16.8 24.1,22.9 26.6,22.9 29.08,20.42 K2.1
FAN_RELAY_1: length 35.3
  Top Layer w0.5: v1(15.9,21.4) 15.52,21.02 Q1.3 15.52,15.56 14.87,14.9
  Bottom Layer w0.5: v1(15.9,21.4) 28.9,34.4 30.88,34.4 36.55,40.07
PA0: length 59.2
  Top Layer w0.254: FPC1.5 31,66.42 31.48,65.95 v1(31.48,63.47) 31.48,62.62 32.38,61.72 C5.1 ; CN2.8 R3.2
  Bottom Layer w0.254: CN2.8 16.25,41.04 16.25,59.3 21.1,64.15 30.8,64.15 v1(31.48,63.47)
PA1: length 53.9
  Top Layer w0.254: C6.1 34.42,63.08 TP9.1 32.33,64.01 v1(32.33,65.1) 32.33,66.27 31.53,67.07 31.53,69.64 FPC1.4 ; CN2.6 R4.2
  Bottom Layer w0.254: CN2.6 15.18,45.04 15.18,59.75 20.53,65.1 v1(32.33,65.1)
PA2: length 49.5
  Top Layer w0.254: CN2.4 R2.1 ; 34.43,64.45 TP8.1 33.12,64.55 v1(33.12,66.46) 32,67.57 FPC1.3
  Bottom Layer w0.254: CN2.4 14.1,49.05 14.1,60.22 20.34,66.46 v1(33.12,66.46)
PA3: length 43.8
  Top Layer w0.254: CN2.2 R1.1 ; FPC1.2 32.5,68.35 33.49,67.37 34.43,66.42 34.43,65.82 C8.1
  Bottom Layer w0.254: v1(33.48,67.36) 19.74,67.36 13.1,60.72 13.1,53.13 CN2.2
PA4: length 31
  Top Layer w0.254: R13.1 v1(52.05,67.31) ; v1(28.17,73.28) 28,73.11 FPC1.11
  Bottom Layer w0.254: v1(28.17,73.28) 28.81,73.28 33,69.09 45.82,69.09 47.16,67.75 50.2,67.75 50.4,67.95 51.41,67.95 v1(52.05,67.31)
PA5: length 26.7
  Top Layer w0.254: R12.1 v1(50.65,67.31) ; v1(28.93,71.76) 28.5,71.33 FPC1.10
  Bottom Layer w0.254: v1(28.93,71.76) 31.98,68.71 45.7,68.71 47.09,67.31 v1(50.65,67.31)
PA6: length 5.8
  Top Layer w0.254: FPC1.9 29,68.78 26.27,66.04 R16.1
PA6_INTERLOCK: length 151.5
  Top Layer w0.5: v1(7.94,58.12) TP3.1 ; v1(7.94,58.12) 8.1,58.27 8.1,60.36 ; v1(7.94,58.12) 9.35,56.71 CN1.8 ; 8.1,65.57 8.1,69.46 10.56,71.93 ; 8.1,65.57 8.1,60.36 ; 8.1,65.57 9.4,66.87 CN1.4 ; 10.56,61.77 9.51,61.77 8.1,60.36
  Bottom Layer w0.5: CN7.6 50.61,30.69 52.7,28.6 52.7,9.4 44.9,1.6 12.5,1.6 7.94,6.16 v1(7.94,58.12)
PA7: length 5.5
  Top Layer w0.254: R17.1 27.66,66.3 29.5,68.14 FPC1.8
PA8: length 5.1
  Top Layer w0.254: R18.1 29.06,66.55 30,67.49 FPC1.7
PA9: length 4.7
  Top Layer w0.254: 30.46,64.95 30.5,65 FPC1.6
PA10: length 21.4
  Top Layer w0.254: v1(27.16,72.39) 27.5,72.04 FPC1.12 ; R14.1 v1(42.65,67.19)
  Bottom Layer w0.254: v1(27.16,72.39) 31.19,68.35 41.48,68.35 v1(42.65,67.19)
PA11: length 23.1
  Top Layer w0.254: v1(26.39,71.63) 27,71.02 FPC1.13 ; R15.1 v1(43.92,67.19)
  Bottom Layer w0.254: v1(26.39,71.63) 27.41,71.63 31.05,68 40.74,68 42.32,66.42 43.16,66.42 v1(43.92,67.19)
PA12: length 5.4
  Top Layer w0.254: 24.87,64.95 24.87,66.68 26.5,68.31 FPC1.14
RESET: length 5
  Top Layer w0.254: FPC1.22 22.5,66.67 23.09,66.08 R7.1
RX0: length 4.8
  Top Layer w0.254: FPC1.23 22,66.75 21.73,66.47 21.73,64.98 R5.1
THERMAL0:
  vias: v1(34.4,14.6) v1(34.4,13.9) v1(34.4,13.13) v1(34.4,12.41) v1(34.4,11.7) v1(35.3,14.6) v1(35.3,13.87) v1(35.27,13.13) v1(35.27,12.43) v1(35.3,11.7) v1(36.14,14.6) v1(36.18,13.79) v1(36.18,13.13) v1(36.18,12.41) v1(36.16,11.7)
TX0: length 5.2
  Top Layer w0.254: FPC1.24 21.5,67.1 20.3,65.9 R6.1
$1N3013: length 67.6
  Top Layer w0.254: R6.2 27.25,57.14 34.86,57.14 40.92,51.07 40.92,21.5 40.2,20.78 40.2,13.72 U3.2
$1N3017: length 64.7
  Top Layer w0.254: R5.2 21.69,63.19 27.39,57.49 35,57.49 41.9,50.6 41.9,20.6 41.3,20 41.3,14.5 42.3,13.51 U3.3
$1N3080: length 58.2
  Top Layer w0.254: U3.5 42.95,50.05 35.15,57.85 27.54,57.85 23.09,62.3 R7.2
$1N3583: length 3.4
  Top Layer w0.254: CN4.3 50.64,70.43 R8.2 50.65,70.29 R12.2
$1N3587: length 3.6
  Top Layer w0.254: CN4.4 51.64,70.84 R9.2 52.12,69.09 R13.2
$1N4118: length 3.7
  Top Layer w0.254: 43.92,70.44 R11.2 ; 43.92,70.44 43.92,68.89 ; 43.92,70.44 43.64,70.71 CN5.4
$1N4125: length 3.5
  Top Layer w0.254: CN5.3 42.65,72.35 42.65,68.89
$1N12881: length 48
  Top Layer w0.254: Q2.1 21.55,23.25 27.4,29.1 27.4,46.1 26.3,47.2 v1(26.3,47.5) ; R17.2 27.7,64.05 v1(27.7,63.2)
  Bottom Layer w0.254: v1(27.7,63.2) 26.3,61.8 v1(26.3,47.5)
$1N13084: length 51.8
  Top Layer w0.254: v1(27.1,47.4) 28.4,46.1 28.4,28.56 Q1.1 ; R18.2 v1(29.06,63.2)
  Bottom Layer w0.254: v1(29.06,63.2) 26.8,60.94 26.8,48.5 27.1,48.2 v1(27.1,47.4)
$1N19649: length 34.8
  Top Layer w0.5: R16.2 26.27,63.03 30.3,59 37.3,59 50.43,45.87 CN7.1
$1N19688: length 2.5
  Top Layer w1: CN7.2 CN7.3
$1N19692: length 2.5
  Top Layer w1: CN7.4 CN7.5

## Copper pours and planes (outline as drawn; the poured copper is in the pictures)
GND on Top Layer: 0,83 61,83 61,0 0,0
GND on Bottom Layer: 0,83 61,83 61,0 0,0
THERMAL0 on Bottom Layer: 28.3,16.59 39.4,16.59 39.4,3.4 28.3,3.4
THERMAL1 on Top Layer: 54.6,66.1 60,66.1 60,51 54.6,51

## Text on the board
Top Silkscreen Layer: GND | FAN1- | NTC_3 | 12V | LED1 | NTC_2 | FAN0- | FAN0+ | NTC_1 | LED0 | LED2 | FAN1+ | 5V | NTC_0 | LED3 | uven2-mk3-main-board / v1.3 | RX0 | TX0 | RST | INT0+ | INT0- | INT1- | INT1+ | INT2- | INT2+ | PA6
